# Altium project Joab da Silva Bezerra- PCEIoT.PrjPcb (part 2 of 2)

## Sheet [5] ButtonsAndLeds.SchDoc: =DocumentName
size A3; Organization: ORGANIZATION; Address1: R. Aprígio Veloso, 882, Universitário; Address2: Campina Grande - PB; Address3: 58429-900; DocumentNumber: 5; Revision: -; SheetNumber: 5; SheetTotal: 9; Project: Joab da Silva Bezerra- PCEIoT.PrjPcb; ENG_DATE: --/--/--; DSN_DATE: --/--/--; CHK_DATE: --/--/--; SCH_SCALE: 1:1
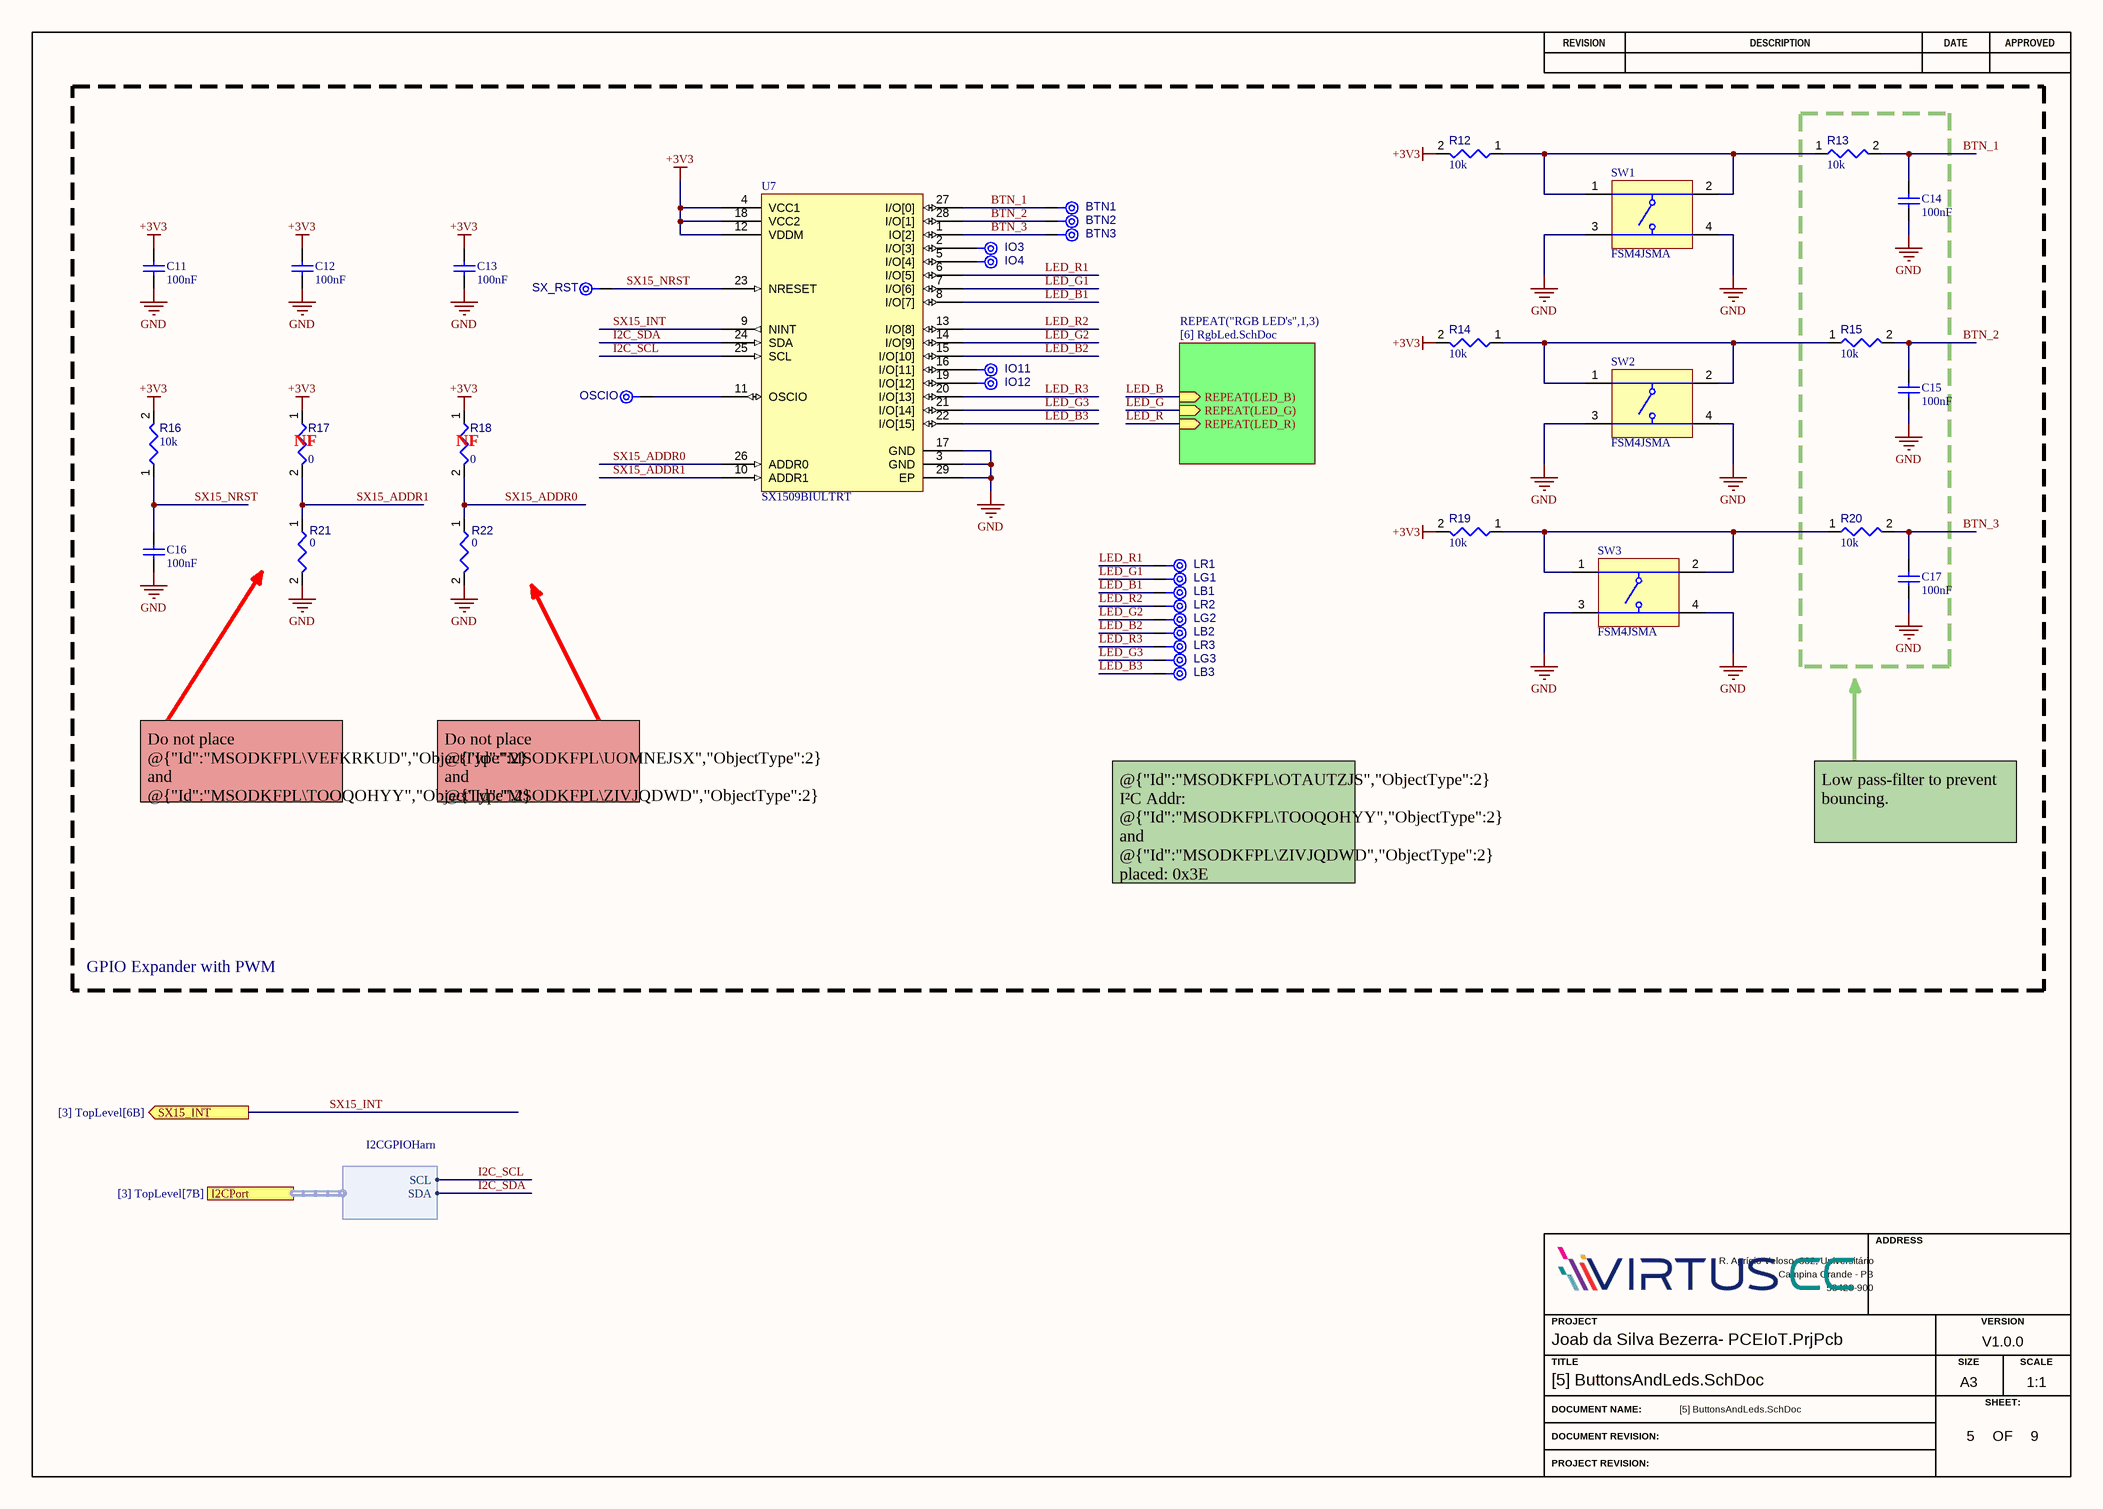
[diagram p6: [5] ButtonsAndLeds.SchDoc]

### Parts
BTN1  TPAD6R  [TP06R]  (value not drawn)  (no BOM)
BTN2  TPAD6R  [TP06R]  (value not drawn)  (no BOM)
BTN3  TPAD6R  [TP06R]  (value not drawn)  (no BOM)
C11  value 100nF  [CAPC0603(1608)100_L]  (hidden comment: VJ0603Y104MXJCW1BC)
C12  value 100nF  [CAPC0603(1608)100_L]  (hidden comment: VJ0603Y104MXJCW1BC)
C13  value 100nF  [CAPC0603(1608)100_L]  (hidden comment: VJ0603Y104MXJCW1BC)
C14  value 100nF  [CAPC0603(1608)100_L]  (hidden comment: VJ0603Y104MXJCW1BC)
C15  value 100nF  [CAPC0603(1608)100_L]  (hidden comment: VJ0603Y104MXJCW1BC)
C16  value 100nF  [CAPC0603(1608)100_L]  (hidden comment: VJ0603Y104MXJCW1BC)
C17  value 100nF  [CAPC0603(1608)100_L]  (hidden comment: VJ0603Y104MXJCW1BC)
IO3  TPAD6R  [TP06R]  (value not drawn)  (no BOM)
IO4  TPAD6R  [TP06R]  (value not drawn)  (no BOM)
IO11  TPAD6R  [TP06R]  (value not drawn)  (no BOM)
IO12  TPAD6R  [TP06R]  (value not drawn)  (no BOM)
LB1  TPAD6R  [TP06R]  (value not drawn)  (no BOM)
LB2  TPAD6R  [TP06R]  (value not drawn)  (no BOM)
LB3  TPAD6R  [TP06R]  (value not drawn)  (no BOM)
LG1  TPAD6R  [TP06R]  (value not drawn)  (no BOM)
LG2  TPAD6R  [TP06R]  (value not drawn)  (no BOM)
LG3  TPAD6R  [TP06R]  (value not drawn)  (no BOM)
LR1  TPAD6R  [TP06R]  (value not drawn)  (no BOM)
LR2  TPAD6R  [TP06R]  (value not drawn)  (no BOM)
LR3  TPAD6R  [TP06R]  (value not drawn)  (no BOM)
OSCIO  TPAD6R  [TP06R]  (value not drawn)  (no BOM)
R12  value 10k  [RESC0603(1608)_L]  (hidden comment: Resistor 10k +/-1% 0603 100 mW)
R13  value 10k  [RESC0603(1608)_L]  (hidden comment: Resistor 10k +/-1% 0603 100 mW)
R14  value 10k  [RESC0603(1608)_L]  (hidden comment: Resistor 10k +/-1% 0603 100 mW)
R15  value 10k  [RESC0603(1608)_L]  (hidden comment: Resistor 10k +/-1% 0603 100 mW)
R16  value 10k  [RESC0603(1608)_L]  (hidden comment: Resistor 10k +/-1% 0603 100 mW)
R17  value 0  [RESC0603(1608)_L]  (hidden comment: Resistor 0R +/- 5% 0603 100 mW)
R18  value 0  [RESC0603(1608)_L]  (hidden comment: Resistor 0R +/- 5% 0603 100 mW)
R19  value 10k  [RESC0603(1608)_L]  (hidden comment: Resistor 10k +/-1% 0603 100 mW)
R20  value 10k  [RESC0603(1608)_L]  (hidden comment: Resistor 10k +/-1% 0603 100 mW)
R21  value 0  [RESC0603(1608)_L]  (hidden comment: Resistor 0R +/- 5% 0603 100 mW)
R22  value 0  [RESC0603(1608)_L]  (hidden comment: Resistor 0R +/- 5% 0603 100 mW)
SW1  FSM4JSMA  [TECO-FSM4JSMA_V]
SW2  FSM4JSMA  [TECO-FSM4JSMA_V]
SW3  FSM4JSMA  [TECO-FSM4JSMA_V]
SX_RST  TPAD6R  [TP06R]  (value not drawn)  (no BOM)
U7  SX1509BIULTRT  [QFN40P410X410X60_HS-29N]

### Sub-sheets
REPEAT("RGB LED's",1,3) = [6] RgbLed.SchDoc: REPEAT(LED_B) (in), REPEAT(LED_G) (in), REPEAT(LED_R) (in)

### Ports
I2CPort (harness I2CGPIOHarn, see [3] TopLevel[7B]), SX15_INT (out, see [3] TopLevel[6B])

### Harnesses
I2CGPIOHarn: SCL, SDA

### Nets
+3V3: C11.2 C12.2 C13.2 R12.2 R14.2 R16.2 R17.1 R18.1 R19.2 U7.4(VCC1) U7.12(VDDM) U7.18(VCC2)
GND: C11.1 C12.1 C13.1 C14.1 C15.1 C16.1 C17.1 R21.2 R22.2 SW1.3 SW1.4 SW2.3 SW2.4 SW3.3 SW3.4 U7.3(GND) U7.17(GND) U7.29(EP)
BTN_1: BTN1.1(TP) C14.2 R13.2 U7.27(I/O[0])
BTN_2: BTN2.1(TP) C15.2 R15.2 U7.28(I/O[1])
BTN_3: BTN3.1(TP) C17.2 R20.2 U7.1(IO[2])
I2C_SCL: U7.25(SCL) ; port I2CPort.SCL  [project net GP5/I2C0_SCL]
I2C_SDA: U7.24(SDA) ; port I2CPort.SDA  [project net GP4/I2C0_SDA]
LED_B: sheet REPEAT("RGB LED's",1,3)/REPEAT(LED_B)
LED_B1: LB1.1(TP) U7.8(I/O[7])  [project net LED_B]
LED_B2: LB2.1(TP) U7.15(I/O[10])  [project net LED_B]
LED_B3: LB3.1(TP) U7.22(I/O[15])  [project net LED_B]
LED_G: sheet REPEAT("RGB LED's",1,3)/REPEAT(LED_G)
LED_G1: LG1.1(TP) U7.7(I/O[6])  [project net LED_G]
LED_G2: LG2.1(TP) U7.14(I/O[9])  [project net LED_G]
LED_G3: LG3.1(TP) U7.21(I/O[14])  [project net LED_G]
LED_R: sheet REPEAT("RGB LED's",1,3)/REPEAT(LED_R)
LED_R1: LR1.1(TP) U7.6(I/O[5])  [project net LED_R]
LED_R2: LR2.1(TP) U7.13(I/O[8])  [project net LED_R]
LED_R3: LR3.1(TP) U7.20(I/O[13])  [project net LED_R]
SX15_ADDR0: R18.2 R22.1 U7.26(ADDR0)
SX15_ADDR1: R17.2 R21.1 U7.10(ADDR1)
SX15_INT: U7.9(NINT) ; port SX15_INT  [project net GP11/SX_INTn]
SX15_NRST: C16.2 R16.1 SX_RST.1(TP) U7.23(NRESET)
NetIO3_1: IO3.1(TP) U7.2(I/O[3])
NetIO4_1: IO4.1(TP) U7.5(I/O[4])
NetIO11_1: IO11.1(TP) U7.16(I/O[11])
NetIO12_1: IO12.1(TP) U7.19(I/O[12])
NetOSCIO_1: OSCIO.1(TP) U7.11(OSCIO)
NetR12_1: R12.1 R13.1 SW1.1 SW1.2
NetR14_1: R14.1 R15.1 SW2.1 SW2.2
NetR19_1: R19.1 R20.1 SW3.1 SW3.2

### Notes on the sheet
- (near R17) NF
- (near R18) NF
- Do not place @{"Id":"MSODKFPL\VEFKRKUD","ObjectType":2} and @{"Id":"MSODKFPL\TOOQOHYY","ObjectType":2}  simultaneously
- Do not place @{"Id":"MSODKFPL\UOMNEJSX","ObjectType":2} and @{"Id":"MSODKFPL\ZIVJQDWD","ObjectType":2}  simultaneously
- Low pass-filter to prevent
  bouncing.
- @{"Id":"MSODKFPL\OTAUTZJS","ObjectType":2}  I²C Addr:
  @{"Id":"MSODKFPL\TOOQOHYY","ObjectType":2} and @{"Id":"MSODKFPL\ZIVJQDWD","ObjectType":2} placed: 0x3E
  @{"Id":"MSODKFPL\TOOQOHYY","ObjectType":2} and @{"Id":"MSODKFPL\UOMNEJSX","ObjectType":2} placed: 0x3F
  @{"Id":"MSODKFPL\VEFKRKUD","ObjectType":2} and @{"Id":"MSODKFPL\ZIVJQDWD","ObjectType":2} placed: 0x70
  @{"Id":"MSODKFPL\VEFKRKUD","ObjectType":2} and @{"Id":"MSODKFPL\UOMNEJSX","ObjectType":2} placed: 0x71
- GPIO Expander with PWM
- REVISION
- DESCRIPTION
- DATE
- APPROVED
- ADDRESS
- PROJECT
- VERSION
- TITLE
- A3
- SIZE
- SCALE
- DOCUMENT NAME:
- DOCUMENT REVISION:
- OF
- SHEET:
- PROJECT REVISION:

### Library data of the parts
BTN1-BTN3 IO3 IO4 IO11 IO12 LB1-LB3 LG1-LG3 LR1-LR3 OSCIO SX_RST = CMP-00028-00002-2: 0.6mm round; Pins: 1
C11-C17 = CMP-001-00085-1: Multilayer Ceramic Capacitor, 0.1 uF, 16 V, ± 20%, X7R, 0603 [1608 Metric]; Dielectric Material: Tantalum; Voltage Rating: 16V; Packaging: Tape and Reel; Min Operating Temperature: -55°C; Case/Package: 0603; Length: 1.6mm; Termination: SMD/SMT; Height: 0.95mm; Mounting Technology: Surface Mount; Width: 0.8mm; Case Code (Imperial): 0603; Construction: Flat; Lead Free: Lead Free; Package Quantity: 4000; Max Operating Temperature: 125°C; Dielectric: X7R; RoHS Compliant: Yes; Depth: 0.8mm; Tolerance: 20%; Series: VJ; Case Code (Metric): 1608; Voltage Rating (DC): 16V
R12-R16 R19 R20 = CMP-009-00017-7: Chip Resistor, 10 KOhm, +/- 1%, 01 W, -55 to 155 degC, 0603 (1608 Metric); Power: 100mW; Voltage Rating: 50V; Mounting Technology: SM; Max Operating Temperature: 155°C; Case/Package: 0603; Tolerance: 1%; RoHS Compliant: True; Pins: 2; Min Operating Temperature: -55°C
R17 R18 R21 R22 = CMP-009-00006-6: Chip Resistor, 0 Ohm, 0.1 W, -55 to 155 degC, 0603 (1608 Metric); Power: 100mW; Voltage Rating: 50V; Tolerance: 5%; Mounting Technology: SM; RoHS Compliant: True; Max Operating Temperature: 155°C; Min Operating Temperature: -55°C; Case/Package: 0603; Pins: 2
SW1-SW3 = CMP-011-00013-1: Switch Tactile OFF (ON) SPST Round Button Gull Wing 0.05A 12VDC 1.57N SMD Loose Piece; Max Current Rating: 50mA; Actuator Type: Standard; Switch Function: Off-Mom; Switch Travel: 0.25mm; Mechanical Life: 100000Cycles; Insulation Resistance: 100MR; Actuator Length: 1.4mm; Voltage Rating: 24V; Actuator Material: Polyphenylene; Illumination Type: Non-Illuminated,Illuminated; Contact Material: Copper Alloy,Silver; Throw Configuration: SPST; Termination: Gull Wing; Depth: 10mm; Series: FSMJSMA; Contact Current Rating: 50mA; ELV: Compliant; Min Operating Temperature: -35°C; Case/Package: SMD/SMT; Length: 6mm; Width: 6mm; Package Quantity: 750; Color: Black; Reach SVHC Compliant: Unknown; Contact Plating: Silver; Operating Force: 1.57N; Current Rating: 50mA; RoHS Compliant: Yes; Max Operating Temperature: 85°C; Lead Free: Lead Free; Voltage Rating (DC): 24V; Packaging: Bulk; Orientation: Straight; Mounting Technology: Surface Mount
U7 = CMP-016-00011-5: IC Gpio Expander I2C 16CH 28QFN / I2C Interface 5.5V 28-PIN Qfn-ut Ep T/r; Number of I/Os: 16; Frequency: 400kHz; Interface: I2C; Series: -; Min Operating Temperature: -40°C; RoHS Compliant: Yes; Pins: 28; Packaging: Cut Tape; Max Operating Temperature: 85°C; Mounting Technology: Surface Mount; Case/Package: QFN; Lead Free: Lead Free

## Sheet [6] RgbLed.SchDoc: =DocumentName
size A3; Organization: ORGANIZATION; Address1: R. Aprígio Veloso, 882, Universitário; Address2: Campina Grande - PB; Address3: 58429-900; DocumentNumber: 6; Revision: -; SheetNumber: 6; SheetTotal: 9; Project: Joab da Silva Bezerra- PCEIoT.PrjPcb; ENG_DATE: --/--/--; DSN_DATE: --/--/--; CHK_DATE: --/--/--; SCH_SCALE: 1:1
Used 3 times, as channels [5] ButtonsAndLeds/"RGB LED's"1, [5] ButtonsAndLeds/"RGB LED's"2, [5] ButtonsAndLeds/"RGB LED's"3. Parts and nets are listed once, with the designators drawn on the sheet.
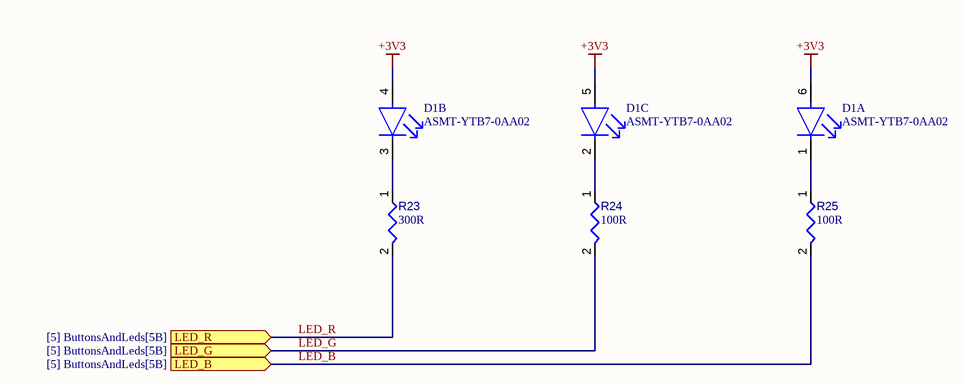
[diagram p7: [6] RgbLed.SchDoc]

### Parts
D1  ASMT-YTB7-0AA02  [FP-PLCC-6-MFG]  (parts A,B,C of 3)
R23  value 300R  [RESC0603(1608)_L]  (hidden comment: ERJ-3GEYJ301V)
R24  value 100R  [RESC0603(1608)_L]  (hidden comment: ERJ-3EKF1000V)
R25  value 100R  [RESC0603(1608)_L]  (hidden comment: ERJ-3EKF1000V)

### Ports
LED_B (in, see [5] ButtonsAndLeds[5B]), LED_G (in, see [5] ButtonsAndLeds[5B]), LED_R (in, see [5] ButtonsAndLeds[5B])

### Nets
+3V3: D1.4(Anode(Red)) D1.5(Anode(Green)) D1.6(Anode(Blue))
LED_B: R25.2 ; port LED_B
LED_G: R24.2 ; port LED_G
LED_R: R23.2 ; port LED_R
NetD1_1: D1.1(Cathode(Blue)) R25.1
NetD1_2: D1.2(Cathode(Green)) R24.1
NetD1_3: D1.3(Cathode(Red)) R23.1

### Channels
[5] ButtonsAndLeds/"RGB LED's"1: designators end in A; ports LED_B=LED_B LED_G=LED_G LED_R=LED_R
[5] ButtonsAndLeds/"RGB LED's"2: designators end in B; ports LED_B=LED_B LED_G=LED_G LED_R=LED_R
[5] ButtonsAndLeds/"RGB LED's"3: designators end in C; ports LED_B=LED_B LED_G=LED_G LED_R=LED_R

### Notes on the sheet
- REVISION
- DESCRIPTION
- DATE
- APPROVED
- ADDRESS
- PROJECT
- VERSION
- TITLE
- A3
- SIZE
- SCALE
- DOCUMENT NAME:
- DOCUMENT REVISION:
- OF
- SHEET:
- PROJECT REVISION:

### Library data of the parts
D1 = CMP-007-00036-1: LED Tri-Color Blue/Green/Red 469nm/529nm/623nm Chip LED 6-Pin PLCC T/R; Lens Size: 2.3mm; Forward Voltage: 3.1V; Lens Transparency: Diffused; Dominant Wavelength: 469nm; Luminous Intensity: 384mcd; Viewing Angle: 120°; Color: Blue,Green,Red; Lens Style: Flat,Square,Diffused,Rectangular; Reverse Voltage: 4V; Number of LEDs: 3; Forward Current: 20mA; Reach SVHC Compliant: No; Case/Package: PLCC; Packaging: Cut Tape; Orientation: Top View; Height: 2mm; Length: 3mm; Contact Plating: Silver; Weight: 40mg; Min Operating Temperature: -40°C; Pins: 6; Series: -; Max Operating Temperature: 100°C; Package Quantity: 2000; Mounting Technology: Surface Mount; Width: 2.8mm; Test Current: 20mA
R23 = CMP-009-00189-1: Res Thick Film 0603 300 Ohm 5% 1/10W ±200ppm/°C Molded SMD Punched Carrier T/R; Power Rating: 100mW; Voltage Rating (DC): 75V; Case Code (Metric): 1608; Termination: SMD/SMT; Series: ERJ; Package Quantity: 1; Case/Package: 0603; Reach SVHC Compliant: Unknown; Min Operating Temperature: -55°C; Contact Plating: Tin; Lead Free: Lead Free; Construction: Rectangular; Height: 0.45mm; Resistance Tolerance: 5%; Technology: THICK FILM; Width: 0.8mm; Max Operating Temperature: 155°C; Number of Terminations: 2; Case Code (Imperial): 0603; Pins: 2; Resistor Type: Thick Film; Voltage Rating: 75V; Length: 1.6mm; RoHS Compliant: Yes; Temperature Coefficient: 200ppm/°C; Features: Automotive AEC-Q200; Max Power Dissipation: 100mW; Military Standard: Not; Depth: 0.8mm; Weight: 7.1E-05oz; Tolerance: 5%; Radiation Hardening: No; Packaging: Tape and Reel; Mounting Technology: Surface Mount
R24 R25 = CMP-009-00188-1: SMD Chip Resistor, 100 Ohm, ï¿½ 1%, 100 mW, 0603 [1608 Metric], Thick Film, Precision; Max Power Dissipation: 100mW; Voltage Rating (DC): 75V; Temperature Coefficient: 100ppm/°C; Case Code (Metric): 1608; Radiation Hardening: No; Resistance Tolerance: 1%; Packaging: Tape and Reel; Contact Plating: Tin; Tolerance: 1%; RoHS Compliant: Yes; Termination: SMD/SMT; Resistor Type: Thick Film; Military Standard: Not; Series: ERJ; Mounting Technology: Surface Mount; Weight: 7.1E-05oz; Number of Terminations: 2; Case/Package: 0603; Package Quantity: 5000; Case Code (Imperial): 0603; Width: 0.8mm; Min Operating Temperature: -55°C; Max Operating Temperature: 155°C; Construction: Rectangular; Height: 0.45mm; Power Rating: 100mW; Length: 1.6mm; Lead Free: Lead Free; Voltage Rating: 75V; Reach SVHC Compliant: No; Features: Automotive AEC-Q200; Depth: 0.8mm

## Sheet [8] Conectors.SchDoc: =DocumentName
size A3; Organization: ORGANIZATION; Address1: R. Aprígio Veloso, 882, Universitário; Address2: Campina Grande - PB; Address3: 58429-900; DocumentNumber: 8; Revision: -; SheetNumber: 8; SheetTotal: 9; Project: Joab da Silva Bezerra- PCEIoT.PrjPcb; ENG_DATE: --/--/--; DSN_DATE: --/--/--; CHK_DATE: --/--/--; SCH_SCALE: 1:1
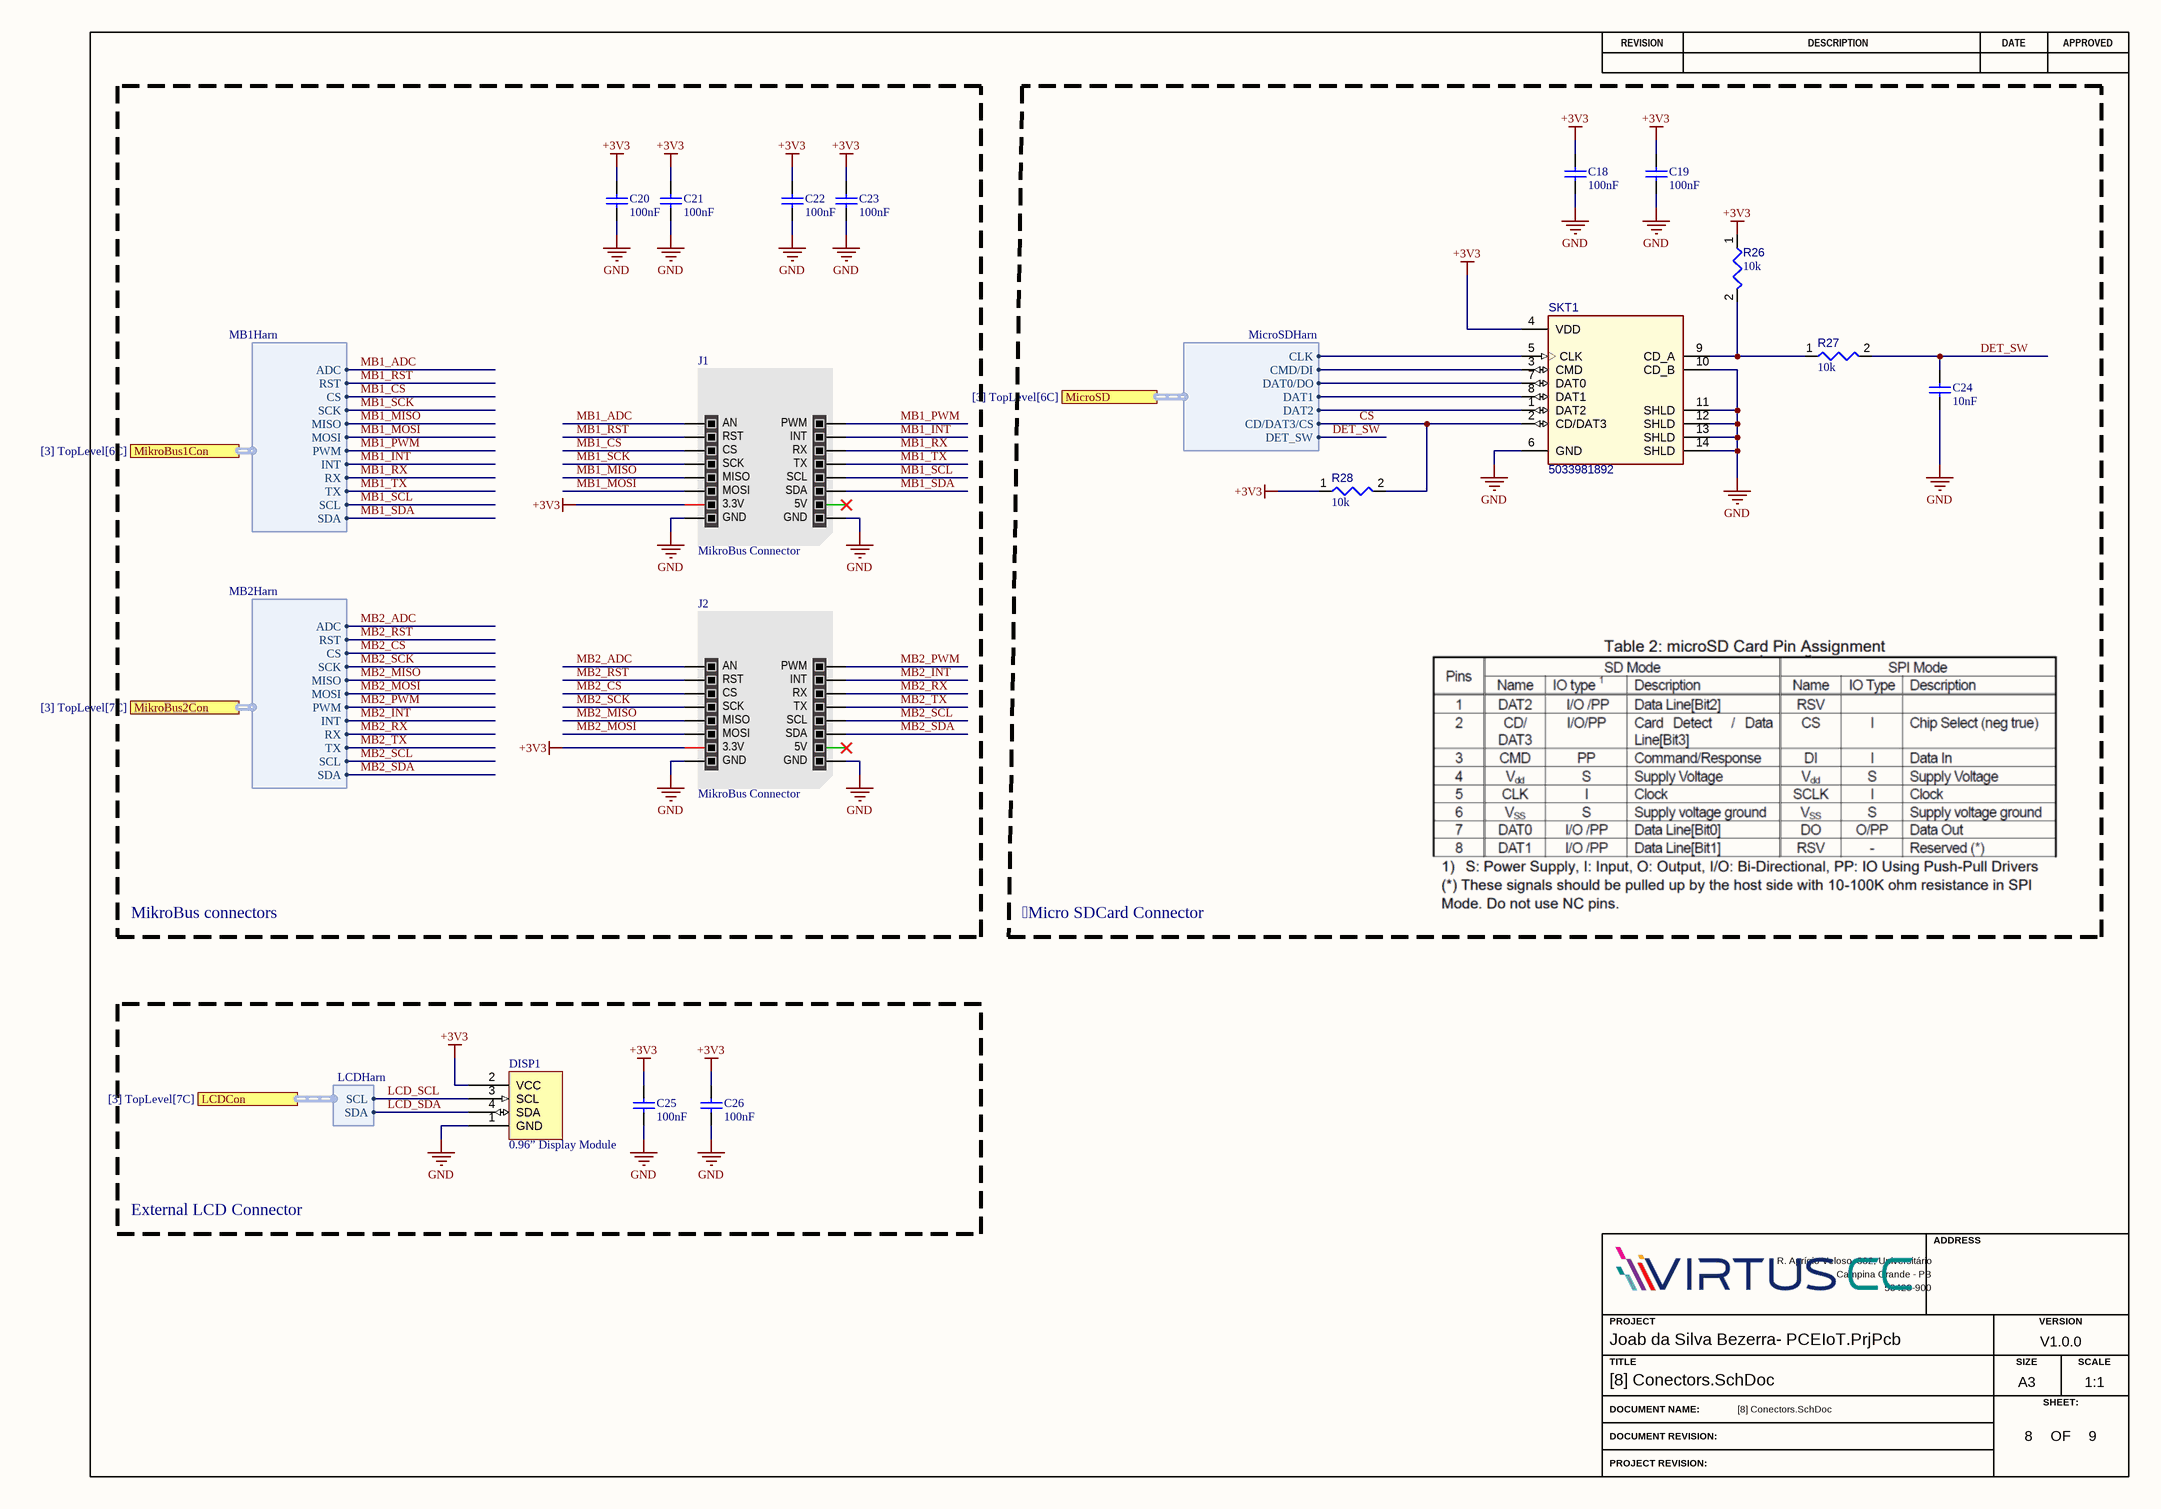
[diagram p8: [8] Conectors.SchDoc]

### Parts
C18  value 100nF  [CAPC0603(1608)100_L]  (hidden comment: VJ0603Y104MXJCW1BC)
C19  value 100nF  [CAPC0603(1608)100_L]  (hidden comment: VJ0603Y104MXJCW1BC)
C20  value 100nF  [CAPC0603(1608)100_L]  (hidden comment: VJ0603Y104MXJCW1BC)
C21  value 100nF  [CAPC0603(1608)100_L]  (hidden comment: VJ0603Y104MXJCW1BC)
C22  value 100nF  [CAPC0603(1608)100_L]  (hidden comment: VJ0603Y104MXJCW1BC)
C23  value 100nF  [CAPC0603(1608)100_L]  (hidden comment: VJ0603Y104MXJCW1BC)
C24  value 10nF  [CAPC0603(1608)100_L]  (hidden comment: VJ0603Y103KXAAC)
C25  value 100nF  [CAPC0603(1608)100_L]  (hidden comment: VJ0603Y104MXJCW1BC)
C26  value 100nF  [CAPC0603(1608)100_L]  (hidden comment: VJ0603Y104MXJCW1BC)
DISP1  0.96” Display Module  [New footprint 1]
J1  MikroBus Connector  [New footprint 1]
J2  MikroBus Connector  [New footprint 1]
R26  value 10k  [RESC0603(1608)_L]  (hidden comment: Resistor 10k +/-1% 0603 100 mW)
R27  value 10k  [RESC0603(1608)_L]  (hidden comment: Resistor 10k +/-1% 0603 100 mW)
R28  value 10k  [RESC0603(1608)_L]  (hidden comment: Resistor 10k +/-1% 0603 100 mW)
SKT1  5033981892  [MOLX-5033981892_V]

### Blocks framed on the sheet
Micro SDCard Connector: C18 C19 C24 R26-R28 SKT1
External LCD Connector: C25 C26 DISP1

### Ports
LCDCon (harness LCDHarn, see [3] TopLevel[7C]), MicroSD (harness MicroSDHarn, see [3] TopLevel[6C]), MikroBus1Con (harness MB1Harn, see [3] TopLevel[6C]), MikroBus2Con (harness MB2Harn, see [3] TopLevel[7C])

### Harnesses
MB1Harn: ADC, RST, CS, SCK, MISO, MOSI, PWM, INT, RX, TX, SCL, SDA
MicroSDHarn: CLK, CMD/DI, DAT0/DO, DAT1, DAT2, CD/DAT3/CS, DET_SW
MB2Harn: ADC, RST, CS, SCK, MISO, MOSI, PWM, INT, RX, TX, SCL, SDA
LCDHarn: SCL, SDA

### Nets
+3V3: C18.2 C19.2 C20.2 C21.2 C22.2 C23.2 C25.2 C26.2 DISP1.2(VCC) J1.7(3.3V) J2.7(3.3V) R26.1 R28.1 SKT1.4(VDD)
GND: C18.1 C19.1 C20.1 C21.1 C22.1 C23.1 C24.1 C25.1 C26.1 DISP1.1(GND) J1.8(GND) J1.9(GND) J2.8(GND) J2.9(GND) SKT1.6(GND) SKT1.10(CD_B) SKT1.11(SHLD) SKT1.12(SHLD) SKT1.13(SHLD) SKT1.14(SHLD)
CS: R28.2 SKT1.2(CD/DAT3) ; port MicroSD.CD/DAT3/CS
DET_SW: C24.2 R27.2 ; port MicroSD.DET_SW
GP16/SPI0_RX: SKT1.7(DAT0) ; port MicroSD.DAT0/DO
GP19/SPI0_TX: SKT1.3(CMD) ; port MicroSD.CMD/DI
LCD_SCL: DISP1.3(SCL) J1.12(SCL) J2.12(SCL) ; port MikroBus1Con.SCL, port MikroBus2Con.SCL, port LCDCon.SCL  [also labelled MB1_SCL, MB2_SCL]  [project net GP5/I2C0_SCL]
LCD_SDA: DISP1.4(SDA) J1.11(SDA) J2.11(SDA) ; port MikroBus1Con.SDA, port MikroBus2Con.SDA, port LCDCon.SDA  [also labelled MB1_SDA, MB2_SDA]  [project net GP4/I2C0_SDA]
MB1_ADC: J1.1(AN) ; port MikroBus1Con.ADC  [project net GP26/MB1_ADC]
MB1_CS: J1.3(CS) ; port MikroBus1Con.CS  [project net GP14/MB1_CS]
MB1_INT: J1.15(INT) ; port MikroBus1Con.INT  [project net GP3/MB1_INT]
MB1_MISO: J1.5(MISO) J2.5(MISO) ; port MikroBus1Con.MISO, port MikroBus2Con.MISO  [also labelled MB2_MISO]
MB1_MOSI: J1.6(MOSI) J2.6(MOSI) ; port MikroBus1Con.MOSI, port MikroBus2Con.MOSI  [also labelled MB2_MOSI]
MB1_PWM: J1.16(PWM) ; port MikroBus1Con.PWM  [project net GP2/MB1_PWM]
MB1_RST: J1.2(RST) ; port MikroBus1Con.RST  [project net GP6/MB1_RST]
MB1_RX: J1.14(RX) ; port MikroBus1Con.RX  [project net GP1/MB1_RX]
MB1_SCK: J1.4(SCK) J2.4(SCK) SKT1.5(CLK) ; port MikroBus1Con.SCK, port MicroSD.CLK, port MikroBus2Con.SCK  [also labelled MB2_SCK]  [project net GP18/SPI0_SCK]
MB1_TX: J1.13(TX) ; port MikroBus1Con.TX  [project net GP0/MB1_TX]
MB2_ADC: J2.1(AN) ; port MikroBus2Con.ADC  [project net GP27/MB2_ADC]
MB2_CS: J2.3(CS) ; port MikroBus2Con.CS  [project net GP22/MB2_CS]
MB2_INT: J2.15(INT) ; port MikroBus2Con.INT  [project net GP21/MB2_INT]
MB2_PWM: J2.16(PWM) ; port MikroBus2Con.PWM  [project net GP7/MB2_PWM]
MB2_RST: J2.2(RST) ; port MikroBus2Con.RST  [project net GP20/MB2_RST]
MB2_RX: J2.14(RX) ; port MikroBus2Con.RX  [project net GP9/MB2_RX]
MB2_TX: J2.13(TX) ; port MikroBus2Con.TX  [project net GP8/MB2_TX]
NetR26_2: R26.2 R27.1 SKT1.9(CD_A)
NetSKT1_1: SKT1.1(DAT2) ; port MicroSD.DAT2
NetSKT1_8: SKT1.8(DAT1) ; port MicroSD.DAT1

Not connected (* = marked no-connect by the designer): J1 10(5V)*; J2 10(5V)*

### Notes on the sheet
- MikroBus connectors
- REVISION
- DESCRIPTION
- DATE
- APPROVED
- ADDRESS
- PROJECT
- VERSION
- TITLE
- A3
- SIZE
- SCALE
- DOCUMENT NAME:
- DOCUMENT REVISION:
- OF
- SHEET:
- PROJECT REVISION:

### Library data of the parts
C18-C23 C25 C26 = CMP-001-00085-1: as C11 on sheet [5] ButtonsAndLeds; Packaging: Tape and Reel; Min Operating Temperature: -55°C; Case/Package: 0603; Length: 1.6mm; Termination: SMD/SMT; Height: 0.95mm; Mounting Technology: Surface Mount; Width: 0.8mm; Case Code (Imperial): 0603; Construction: Flat; Lead Free: Lead Free; Package Quantity: 4000; Max Operating Temperature: 125°C; Dielectric: X7R; RoHS Compliant: Yes; Depth: 0.8mm; Tolerance: 20%; Series: VJ; Case Code (Metric): 1608; Voltage Rating (DC): 16V
C24 = CMP-001-00084-1: Multilayer Ceramic Capacitor, 0.01 uF, 50 V, ± 10%, X7R, 0603 [1608 Metric]; Voltage Rating: 50V; Height: 0.92mm; Voltage Rating (DC): 50V; Depth: 0.8mm; Case Code (Imperial): 0603; Packaging: Tape and Reel; Length: 1.6mm; Max Operating Temperature: 125°C; Min Operating Temperature: -55°C; Case/Package: 0603; Pins: 2; Series: VJ; Thickness: 0.036inch; Weight: 7.1E-05oz; Reach SVHC Compliant: Unknown; Termination: SMD/SMT; Package Quantity: 1; RoHS Compliant: Yes; Mounting Technology: Surface Mount; Construction: Flat; Voltage: 50V; Lead Free: Lead Free; Width: 0.031inch; Case Code (Metric): 1608; Tolerance: 10%; Dielectric: X7R
DISP1 = CMP-003-00030-5: 0.96 Inch I2C OLED Display Module
J1 J2 = CMP-002-00071-3: MikroBus shield pico
R26-R28 = CMP-009-00017-7: as R12 on sheet [5] ButtonsAndLeds; Mounting Technology: SM; Max Operating Temperature: 155°C; Case/Package: 0603; Tolerance: 1%; RoHS Compliant: True; Pins: 2; Min Operating Temperature: -55°C
SKT1 = CMP-002-00049-5: Micro SD Card Connector, Pitch 1.1 mm, 8 Position, Height 1.4 mm, -25 to 85 degC, RoHS, Tape and Reel; Pins: 14

## Nets that join several sheets
+3V3: [3] TopLevel (+3V3.1 R29.2 R30.2 U1.36), [4] Sensors (14 pins), [5] ButtonsAndLeds (12 pins), [5] ButtonsAndLeds/"RGB LED's"1 (D1A.4 D1A.5 D1A.6), [5] ButtonsAndLeds/"RGB LED's"2 (D1B.4 D1B.5 D1B.6), [5] ButtonsAndLeds/"RGB LED's"3 (D1C.4 D1C.5 D1C.6), [8] Conectors (14 pins)
GND: [3] TopLevel (17 pins), [7] PowerManagement (9 pins), [4] Sensors (16 pins), [5] ButtonsAndLeds (18 pins), [8] Conectors (20 pins)
VBUS: [3] TopLevel (U1.40 VBUS.1), [7] PowerManagement (5 pins)
VREF: [3] TopLevel (U1.35 VREF.1), [7] PowerManagement (U8.1)
VSYS: [3] TopLevel (R31.2 U1.39 VSYS.1), [7] PowerManagement (Q1.2)
CS: [3] TopLevel (SCS.1 U1.22), [8] Conectors (R28.2 SKT1.2)
DET_SW: [3] TopLevel (SW.1 U1.20), [8] Conectors (C24.2 R27.2)
GP0/MB1_TX: [3] TopLevel (TX1.1 U1.1), [8] Conectors (J1.13)
GP1/MB1_RX: [3] TopLevel (RX1.1 U1.2), [8] Conectors (J1.14)
GP2/MB1_PWM: [3] TopLevel (PWM1.1 U1.4), [8] Conectors (J1.16)
GP3/MB1_INT: [3] TopLevel (INT1.1 U1.5), [8] Conectors (J1.15)
GP4/I2C0_SDA: [3] TopLevel (R30.1 SDA.1 U1.6), [4] Sensors (U3.8 U4.2 U5.1), [5] ButtonsAndLeds (U7.24), [8] Conectors (DISP1.4 J1.11 J2.11)
GP5/I2C0_SCL: [3] TopLevel (R29.1 SCL.1 U1.7), [4] Sensors (U3.5 U4.3 U5.2), [5] ButtonsAndLeds (U7.25), [8] Conectors (DISP1.3 J1.12 J2.12)
GP6/MB1_RST: [3] TopLevel (RST1.1 U1.9), [8] Conectors (J1.2)
GP7/MB2_PWM: [3] TopLevel (PWM2.1 U1.10), [8] Conectors (J2.16)
GP8/MB2_TX: [3] TopLevel (TX2.1 U1.11), [8] Conectors (J2.13)
GP9/MB2_RX: [3] TopLevel (RX2.1 U1.12), [8] Conectors (J2.14)
GP10/MOT_CSn: [3] TopLevel (ICS.1 U1.14), [4] Sensors (U2.12)
GP11/SX_INTn: [3] TopLevel (SINT.1 U1.15), [5] ButtonsAndLeds (U7.9)
GP12/ICM_INT1: [3] TopLevel (IINT.1 U1.16), [4] Sensors (R1.1 U2.4)
GP13/OPT_INT: [3] TopLevel (OINT.1 U1.17), [4] Sensors (R2.1 U3.7)
GP14/MB1_CS: [3] TopLevel (CS1.1 U1.19), [8] Conectors (J1.3)
GP16/SPI0_RX: [3] TopLevel (MISO.1 R32.2 R35.2 U1.21), [4] Sensors (U2.1), [8] Conectors (SKT1.7)
GP18/SPI0_SCK: [3] TopLevel (SCK.1 U1.24), [4] Sensors (U2.13), [8] Conectors (J1.4 J2.4 SKT1.5)
GP19/SPI0_TX: [3] TopLevel (MOSI.1 R34.2 R36.2 U1.25), [4] Sensors (U2.14), [8] Conectors (SKT1.3)
GP20/MB2_RST: [3] TopLevel (RST2.1 U1.26), [8] Conectors (J2.2)
GP21/MB2_INT: [3] TopLevel (INT2.1 U1.27), [8] Conectors (J2.15)
GP22/MB2_CS: [3] TopLevel (CS2.1 U1.29), [8] Conectors (J2.3)
GP26/MB1_ADC: [3] TopLevel (ADC1.1 U1.31), [8] Conectors (J1.1)
GP27/MB2_ADC: [3] TopLevel (ADC2.1 U1.32), [8] Conectors (J2.1)
LED_B: [5] ButtonsAndLeds (LB1.1 U7.8), [5] ButtonsAndLeds/"RGB LED's"1 (R25A.2)
LED_B: [5] ButtonsAndLeds (LB2.1 U7.15), [5] ButtonsAndLeds/"RGB LED's"2 (R25B.2)
LED_B: [5] ButtonsAndLeds (LB3.1 U7.22), [5] ButtonsAndLeds/"RGB LED's"3 (R25C.2)
LED_G: [5] ButtonsAndLeds (LG1.1 U7.7), [5] ButtonsAndLeds/"RGB LED's"1 (R24A.2)
LED_G: [5] ButtonsAndLeds (LG2.1 U7.14), [5] ButtonsAndLeds/"RGB LED's"2 (R24B.2)
LED_G: [5] ButtonsAndLeds (LG3.1 U7.21), [5] ButtonsAndLeds/"RGB LED's"3 (R24C.2)
LED_R: [5] ButtonsAndLeds (LR1.1 U7.6), [5] ButtonsAndLeds/"RGB LED's"1 (R23A.2)
LED_R: [5] ButtonsAndLeds (LR2.1 U7.13), [5] ButtonsAndLeds/"RGB LED's"2 (R23B.2)
LED_R: [5] ButtonsAndLeds (LR3.1 U7.20), [5] ButtonsAndLeds/"RGB LED's"3 (R23C.2)
MB1_MISO: [3] TopLevel (MB_MISO.1 R32.1 R34.1), [8] Conectors (J1.5 J2.5)
MB1_MOSI: [3] TopLevel (MB_MOSI.1 R35.1 R36.1), [8] Conectors (J1.6 J2.6)
MIC_OUT: [3] TopLevel (MOUT.1 P1.1), [4] Sensors (C9.2 R10.1 R10.2 U6.4)

## Assembly variants
Fabricação: not fitted DISP1 IO3 J1 J2 R4 R17 R18 R34 R35